# EAGLE design christmas_tree (EAGLE 5.10)
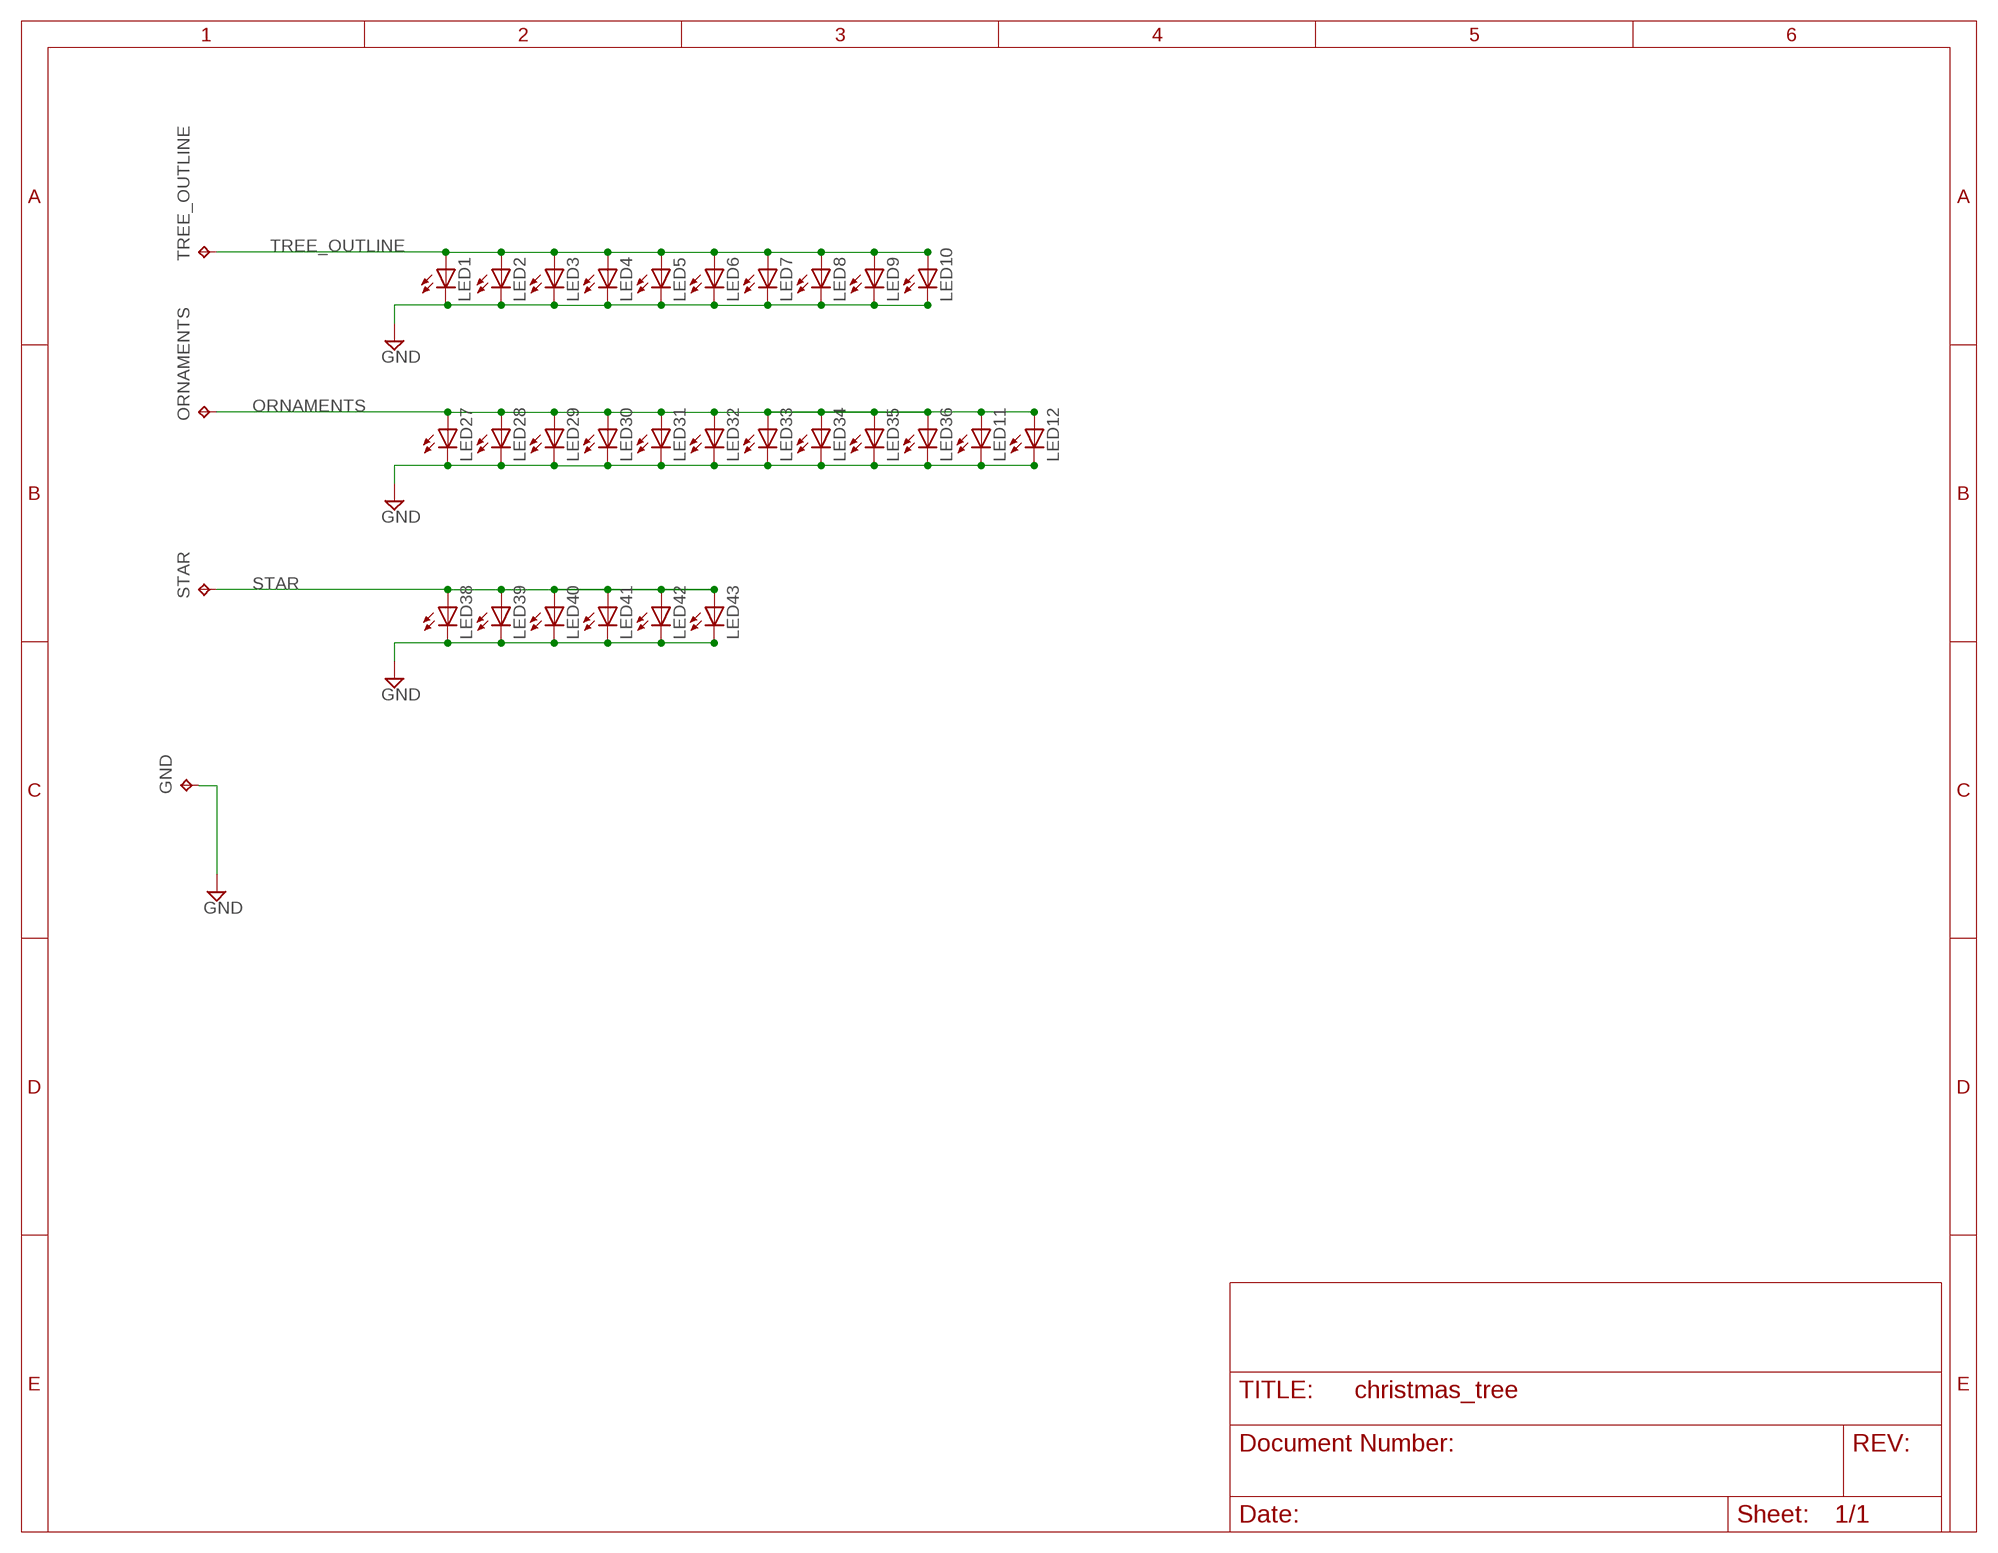
[diagram p0: schematic, sheet 1]

## Parts
GND  TPPAD1-20  [P1-20]
LED1  LED5MM_LARGE_PAD  [LED5MM]
LED2  LED5MM_LARGE_PAD  [LED5MM]
LED3  LED5MM_LARGE_PAD  [LED5MM]
LED4  LED5MM_LARGE_PAD  [LED5MM]
LED5  LED5MM_LARGE_PAD  [LED5MM]
LED6  LED5MM_LARGE_PAD  [LED5MM]
LED7  LED5MM_LARGE_PAD  [LED5MM]
LED8  LED5MM_LARGE_PAD  [LED5MM]
LED9  LED5MM_LARGE_PAD  [LED5MM]
LED10  LED5MM_LARGE_PAD  [LED5MM]
LED11  LED5MM_LARGE_PAD  [LED5MM]
LED12  LED5MM_LARGE_PAD  [LED5MM]
LED27  LED5MM_LARGE_PAD  [LED5MM]
LED28  LED5MM_LARGE_PAD  [LED5MM]
LED29  LED5MM_LARGE_PAD  [LED5MM]
LED30  LED5MM_LARGE_PAD  [LED5MM]
LED31  LED5MM_LARGE_PAD  [LED5MM]
LED32  LED5MM_LARGE_PAD  [LED5MM]
LED33  LED5MM_LARGE_PAD  [LED5MM]
LED34  LED5MM_LARGE_PAD  [LED5MM]
LED35  LED5MM_LARGE_PAD  [LED5MM]
LED36  LED5MM_LARGE_PAD  [LED5MM]
LED38  LED5MM_LARGE_PAD  [LED5MM]
LED39  LED5MM_LARGE_PAD  [LED5MM]
LED40  LED5MM_LARGE_PAD  [LED5MM]
LED41  LED5MM_LARGE_PAD  [LED5MM]
LED42  LED5MM_LARGE_PAD  [LED5MM]
LED43  LED5MM_LARGE_PAD  [LED5MM]
ORNAMENTS  TPPAD1-20  [P1-20]
STAR  TPPAD1-20  [P1-20]
TREE_OUTLINE  TPPAD1-20  [P1-20]

## Nets
GND: GND.TP LED1.K(C) LED2.K(C) LED3.K(C) LED4.K(C) LED5.K(C) LED6.K(C) LED7.K(C) LED8.K(C) LED9.K(C) LED10.K(C) LED11.K(C) LED12.K(C) LED27.K(C) LED28.K(C) LED29.K(C) LED30.K(C) LED31.K(C) LED32.K(C) LED33.K(C) LED34.K(C) LED35.K(C) LED36.K(C) LED38.K(C) LED39.K(C) LED40.K(C) LED41.K(C) LED42.K(C) LED43.K(C)
ORNAMENTS: LED11.A LED12.A LED27.A LED28.A LED29.A LED30.A LED31.A LED32.A LED33.A LED34.A LED35.A LED36.A ORNAMENTS.TP
STAR: LED38.A LED39.A LED40.A LED41.A LED42.A LED43.A STAR.TP
TREE_OUTLINE: LED1.A LED2.A LED3.A LED4.A LED5.A LED6.A LED7.A LED8.A LED9.A LED10.A TREE_OUTLINE.TP

## Library data of the parts
GND ORNAMENTS STAR TREE_OUTLINE = testpad:TP: Test pad
LED1-LED12 LED27-LED36 LED38-LED43 = led:LED: LED OSRAM: - CHIPLED LG R971, LG N971, LY N971, LG Q971, LY Q971, LO R971, LY R971 LH N974, LH R974 LS Q976, LO Q976, LY Q976 LO Q996 - Hyper CHIPLED LW Q18S LB Q993, LB Q99A, LB R99A - SideLED LS A670, LO A670, LY A670, LG A670, LP A670 LB A673, LV A673, LT A673, LW A673 LH A674 LY A675 LS A676, LA A676, LO A676, LY A676, LW A676 LS A679, LY A679, LG A679 - Hyper Micro SIDELED® LS Y876, LA Y876, LO Y876, LY Y876 LT Y87S - SmartLED LW L88C, LW L88S LB L89C, LB L89S, LG L890 LS L89K, LO L89K, LY L89K LS L896, LA L896, LO L896, LY L896 - TOPLED LS T670, LO T670, LY T670, LG T670, LP T670 LSG T670, LSP T670, LSY T670, LOP T670, LYG T670 LG T671, LOG T671, LSG T671 LB T673, LV T673, LT T673, LW T673 LH T674 LS T676, LA T676, LO T676, LY T676, LB T676, LH T676, LSB T676, LW T676 LB T67C, LV T67C, LT T67C, LS T67K, LO T67K, LY T67K, LW E67C LS E67B, LA E67B, LO E67B, LY E67B, LB E67C, LV E67C, LT E67C LW T67C LS T679, LY T679, LG T679 LS T770, LO T770, LY T770, LG T770, LP T770 LB T773, LV T773, LT T773, LW T773 LH T774 LS E675, LA E675, LY E675, LS T675 LS T776, LA T776, LO T776, LY T776, LB T776 LHGB T686 LT T68C, LB T68C - Hyper Mini TOPLED® LB M676 - Mini TOPLED Santana® LG M470 LS M47K, LO M47K, LY M47K Source: http://www.osram.convergy.de LUXEON: - LUMILED® LXK2-PW12-R00, LXK2-PW12-S00, LXK2-PW14-U00, LXK2-PW14-V00 LXK2-PM12-R00, LXK2-PM12-S00, LXK2-PM14-U00 LXK2-PE12-Q00, LXK2-PE12-R00, LXK2-PE12-S00, LXK2-PE14-T00, LXK2-PE14-U00 LXK2-PB12-K00, LXK2-PB12-L00, LXK2-PB12-M00, LXK2-PB14-N00, LXK2-PB14-P00, LXK2-PB14-Q00 LXK2-PR12-L00, LXK2-PR12-M00, LXK2-PR14-Q00, LXK2-PR14-R00 LXK2-PD12-Q00, LXK2-PD12-R00, LXK2-PD12-S00 LXK2-PH12-R00, LXK2-PH12-S00 LXK2-PL12-P00, LXK2-PL12-Q00, LXK2-PL12-R00 Source: www.luxeon.com KINGBRIGHT: KA-3528ASYC Source: www.kingbright.com

## Board
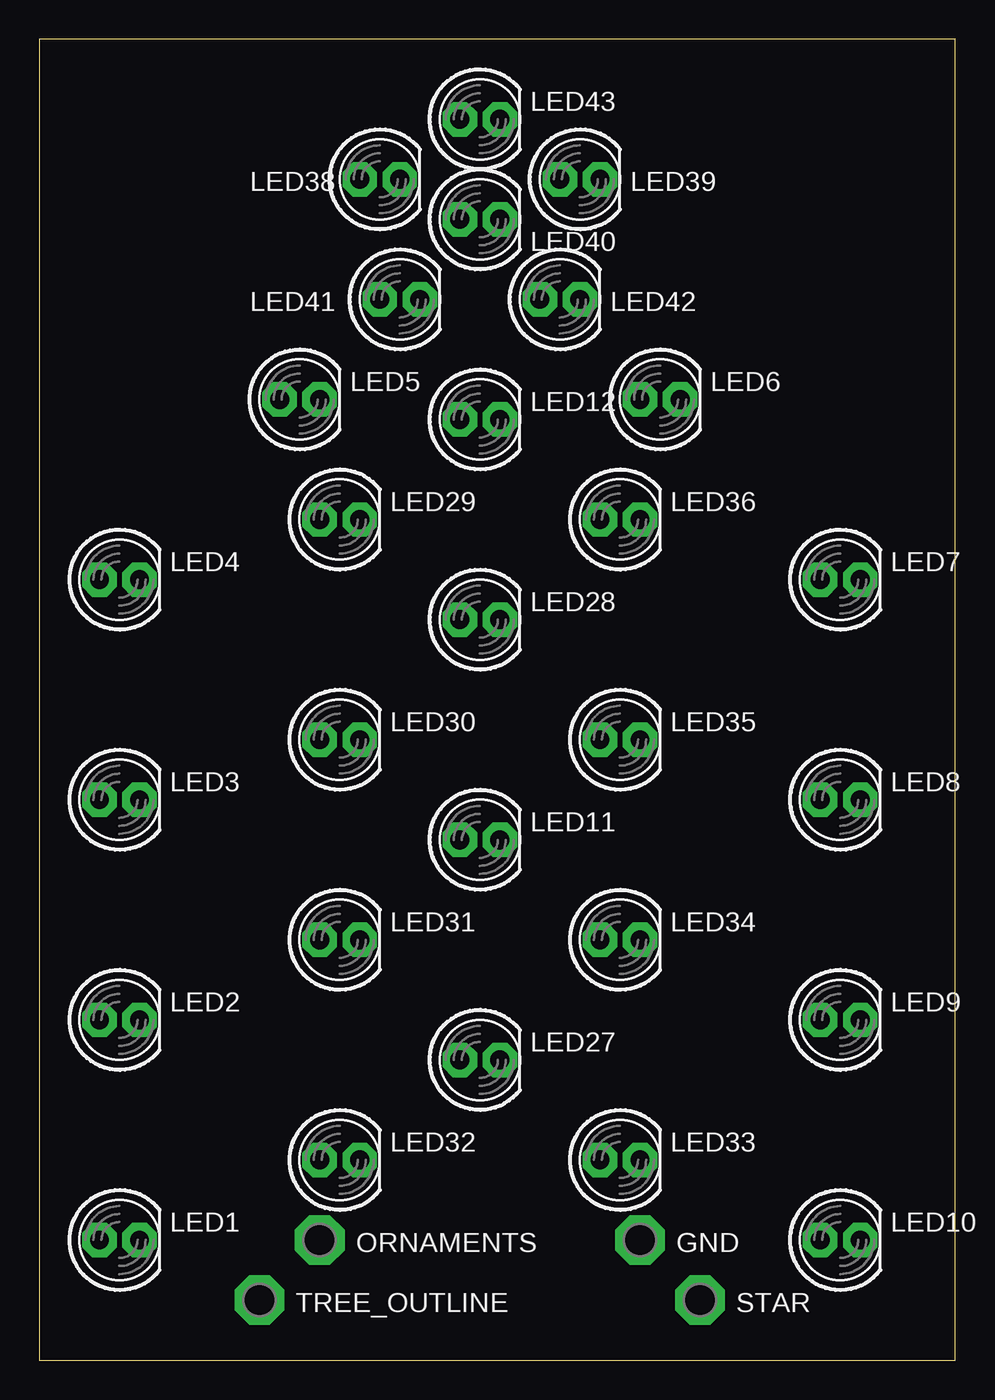
[diagram p1: board, top side]
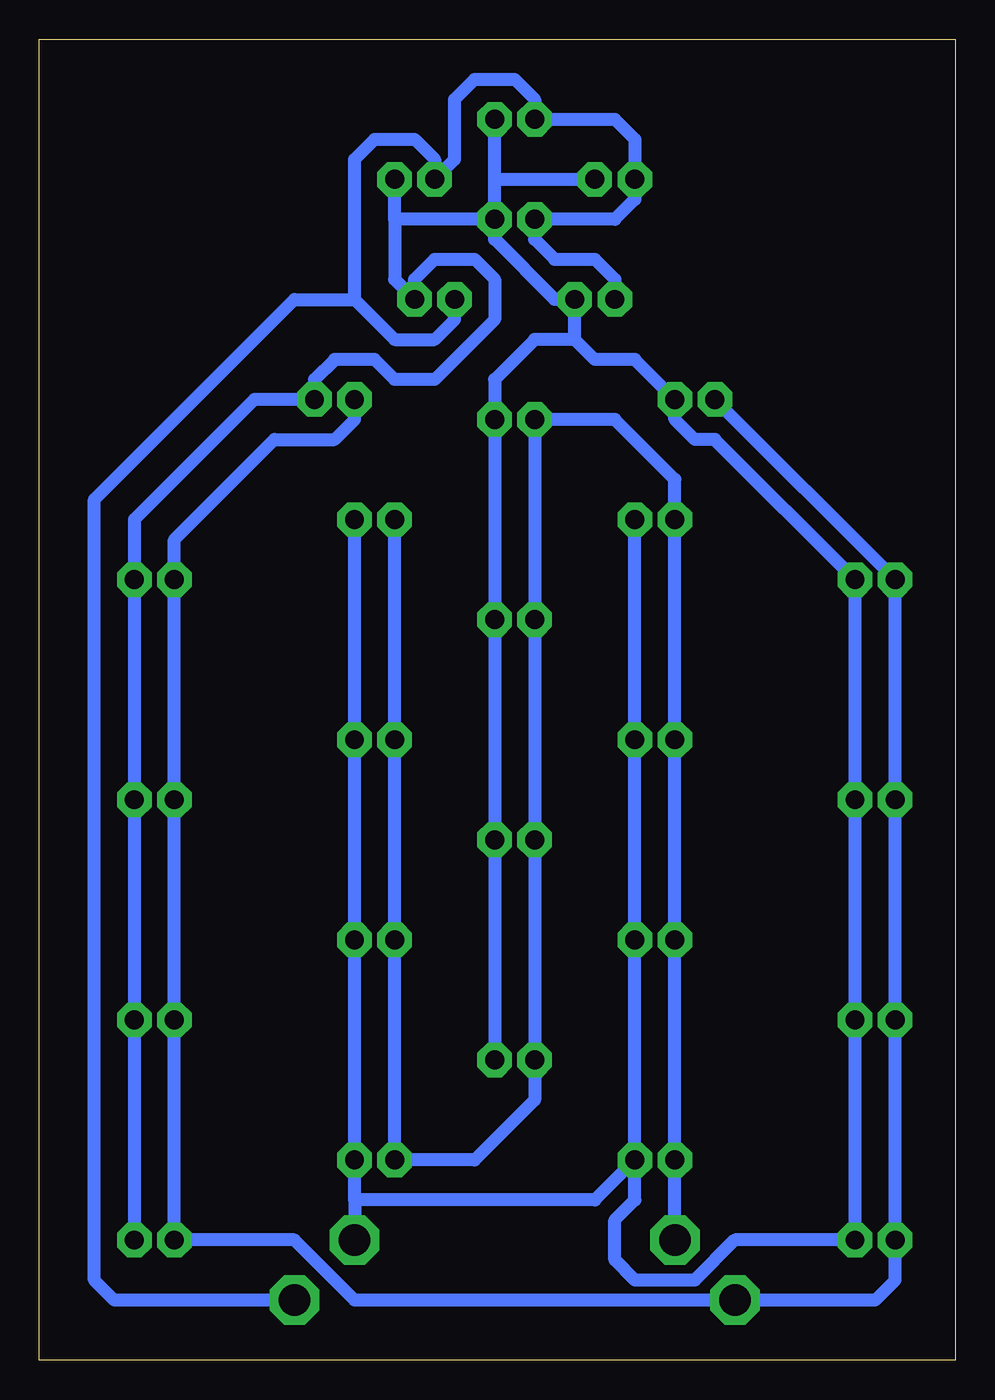
[diagram p2: board, bottom side, seen from below]

Size 58.09 x 83.81 mm. Coordinates in mm from the lower left corner, seen from the top.
Outline: 0,0 58.09,0 58.09,83.81 0,83.81 0,0
Copper layers (1*16): Top 0.035mm / dielectric 1.5mm / Bottom 0.035mm
Design rules "default": minimum track width 10mil, minimum drill 24mil, track to track 8mil, track to pad 8mil, pad to pad 8mil, via to via 8mil, smd to smd 8mil, copper to edge 40mil, drill to drill 8mil, minimum pad ring 10mil, minimum via ring 8mil, stop-mask expansion 4mil, vias tented up to drill 0mil, thermal gap 10mil

### Footprints (pad centres in the part's own frame; a part is rotated, then mirrored left to right if it is on the bottom)
P1-20 = drill 2.007 pad 3.15 octagon: TP 0,0
LED5MM = drill 1.2 pad 2.184 octagon: A -1.27,0; K 1.27,0

### Placement (x,y rotation side)
GND  38.1,7.62 0 top
LED1  5.08,7.62 0 top
LED2  5.08,21.59 0 top
LED3  5.08,35.56 0 top
LED4  5.08,49.53 0 top
LED5  16.51,60.96 0 top
LED6  39.37,60.96 0 top
LED7  50.8,49.53 0 top
LED8  50.8,35.56 0 top
LED9  50.8,21.59 0 top
LED10  50.8,7.62 0 top
LED11  27.94,33.02 0 top
LED12  27.94,59.69 0 top
LED27  27.94,19.05 0 top
LED28  27.94,46.99 0 top
LED29  19.05,53.34 0 top
LED30  19.05,39.37 0 top
LED31  19.05,26.67 0 top
LED32  19.05,12.7 0 top
LED33  36.83,12.7 0 top
LED34  36.83,26.67 0 top
LED35  36.83,39.37 0 top
LED36  36.83,53.34 0 top
LED38  21.59,74.93 0 top
LED39  34.29,74.93 0 top
LED40  27.94,72.39 0 top
LED41  22.86,67.31 0 top
LED42  33.02,67.31 0 top
LED43  27.94,78.74 0 top
ORNAMENTS  17.78,7.62 0 top
STAR  41.91,3.81 0 top
TREE_OUTLINE  13.97,3.81 0 top

### Tracks (layer width: path | path; a pad name or v marks a point on that pad's centre or on a via)
GND
  Bottom 0.813: LED10.K LED9.K LED8.K LED7.K 52.07,53.34 44.45,60.96 LED6.K 40.64,62.23 39.37,63.5 36.83,63.5 35.56,62.23 33.02,62.23 29.21,66.04 29.21,68.58 30.48,69.85 33.02,69.85 34.29,68.58 LED42.K 35.56,68.58 35.56,72.39 | LED40.K 29.21,71.12 25.4,67.31 LED41.K 24.13,64.77 | 29.21,74.93 LED38.K | 29.21,74.93 LED43.K | 35.56,72.39 LED39.K | LED40.K 35.56,72.39 | LED40.K 29.21,74.93 | LED36.K LED35.K LED34.K LED33.K 38.1,10.16 | LED29.K LED30.K LED31.K LED32.K | LED27.K LED11.K LED28.K LED12.K 29.21,62.23 26.67,64.77 24.13,64.77 | 24.13,64.77 22.86,63.5 20.32,63.5 LED5.K 17.78,59.69 16.51,58.42 15.24,58.42 LED4.K LED3.K LED2.K LED1.K 13.97,7.62 16.51,5.08 20.32,5.08 21.59,6.35 21.59,8.89 20.32,10.16 LED32.K | 38.1,10.16 GND.TP | 38.1,10.16 22.86,10.16 LED32.K
ORNAMENTS
  Bottom 0.813: LED36.A LED35.A LED34.A LED33.A 30.48,12.7 26.67,16.51 LED27.A LED11.A LED28.A LED12.A 21.59,59.69 17.78,55.88 LED29.A LED30.A LED31.A LED32.A ORNAMENTS.TP
STAR
  Bottom 0.813: LED41.A 21.59,68.58 22.86,69.85 25.4,69.85 26.67,71.12 LED40.A 21.59,72.39 20.32,73.66 LED38.A 20.32,77.47 21.59,78.74 LED43.A 26.67,80.01 27.94,81.28 30.48,81.28 31.75,80.01 31.75,76.2 LED39.A 33.02,76.2 34.29,77.47 36.83,77.47 38.1,76.2 38.1,67.31 | STAR.TP 53.34,3.81 54.61,5.08 54.61,54.61 41.91,67.31 38.1,67.31 | LED42.A 31.75,66.04 33.02,64.77 35.56,64.77 38.1,67.31
TREE_OUTLINE
  Bottom 0.813: LED5.A LED4.A LED3.A LED2.A LED1.A 3.81,5.08 5.08,3.81 TREE_OUTLINE.TP 38.1,3.81 41.91,7.62 LED10.A LED9.A LED8.A LED7.A 49.53,52.07 43.18,58.42 39.37,58.42 38.1,59.69 LED6.A